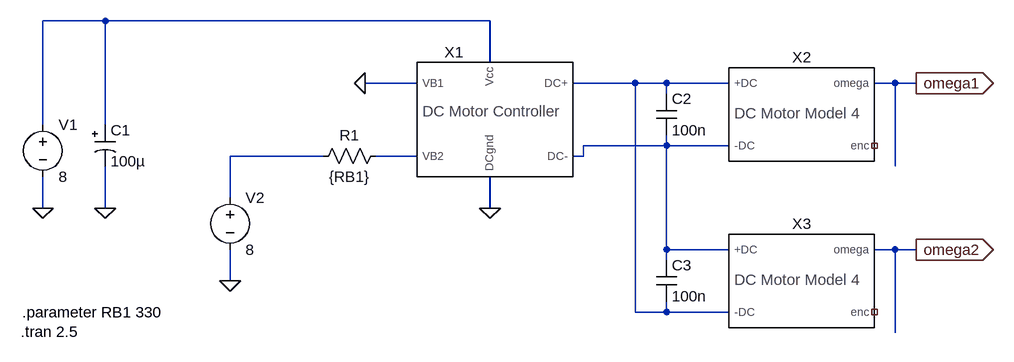
[diagram p0: schematic hbridge-2motor.asc]
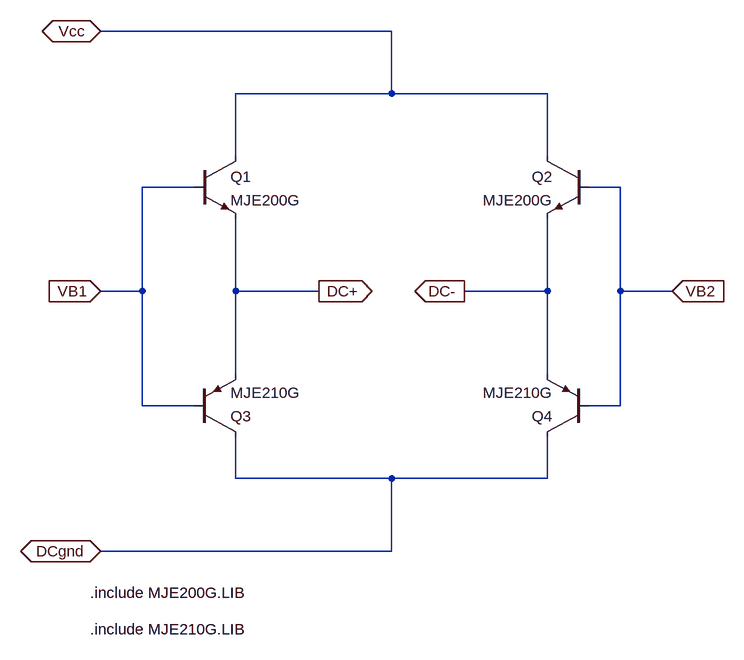
[diagram p1: sub-circuit dc_motor_driver.asc]
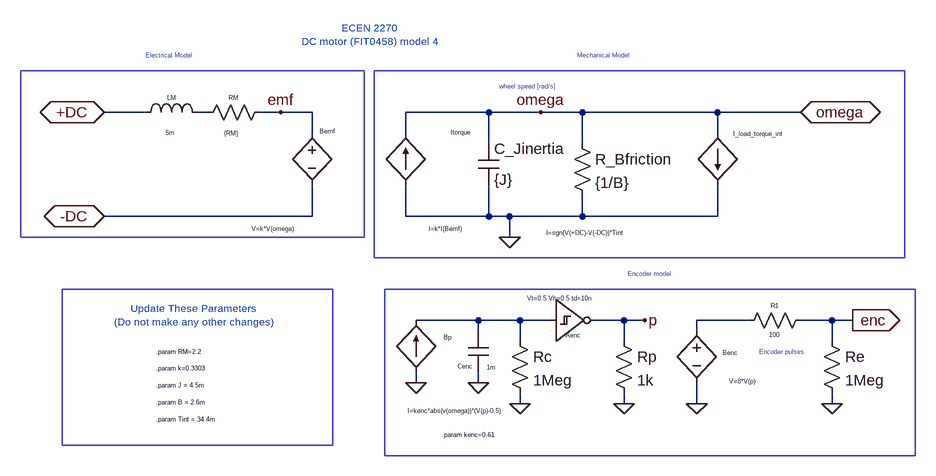
[diagram p2: sub-circuit dc_motor_model4.asc]
hbridge-2motor.asc, the LTspice schematic file:
Version 4
SHEET 1 1772 680
WIRE 144 -32 48 -32
WIRE 736 -32 144 -32
WIRE 736 32 736 -32
WIRE 624 64 544 64
WIRE 960 64 864 64
WIRE 1008 64 960 64
WIRE 1104 64 1008 64
WIRE 1360 64 1328 64
WIRE 1392 64 1360 64
WIRE 1008 80 1008 64
WIRE 48 128 48 -32
WIRE 144 128 144 -32
WIRE 1008 160 1008 144
WIRE 1008 160 880 160
WIRE 1104 160 1008 160
WIRE 480 176 336 176
WIRE 624 176 560 176
WIRE 880 176 880 160
WIRE 880 176 864 176
WIRE 1360 192 1360 64
WIRE 336 240 336 176
WIRE 48 256 48 208
WIRE 144 256 144 192
WIRE 736 256 736 208
WIRE 1008 320 1008 160
WIRE 1104 320 1008 320
WIRE 1360 320 1328 320
WIRE 1392 320 1360 320
WIRE 1008 336 1008 320
WIRE 336 368 336 320
WIRE 960 416 960 64
WIRE 1008 416 1008 400
WIRE 1008 416 960 416
WIRE 1104 416 1008 416
WIRE 1360 448 1360 320
FLAG 336 368 0
FLAG 144 256 0
FLAG 48 256 0
FLAG 736 256 0
FLAG 1392 64 omega1
IOPIN 1392 64 Out
FLAG 1392 320 omega2
IOPIN 1392 320 Out
FLAG 544 64 0
SYMBOL voltage 48 112 R0
SYMATTR InstName V1
SYMATTR Value 8
SYMBOL voltage 336 224 R0
SYMATTR InstName V2
SYMATTR Value 8
SYMBOL polcap 128 128 R0
SYMATTR InstName C1
SYMATTR Value 100µ
SYMBOL res 576 160 R90
WINDOW 0 0 56 VBottom 2
WINDOW 3 32 56 VTop 2
SYMATTR InstName R1
SYMATTR Value {RB1}
SYMBOL DC_Motor_Driver 704 96 R0
SYMATTR InstName X1
SYMBOL cap 992 80 R0
SYMATTR InstName C2
SYMATTR Value 100n
SYMBOL cap 992 336 R0
SYMATTR InstName C3
SYMATTR Value 100n
SYMBOL DC_motor_model4 1200 112 R0
SYMATTR InstName X2
SYMBOL DC_motor_model4 1200 368 R0
SYMATTR InstName X3
TEXT 16 416 Left 2 !.parameter RB1 330
TEXT 14 446 Left 2 !.tran 2.5

dc_motor_driver.asc, the sub-circuit schematic file:
Version 4
SHEET 1 1272 872
WIRE 128 -336 -320 -336
WIRE 128 -240 128 -336
WIRE 128 -240 -112 -240
WIRE 368 -240 128 -240
WIRE -112 -144 -112 -240
WIRE 368 -144 368 -240
WIRE -176 -96 -256 -96
WIRE 480 -96 432 -96
WIRE -256 64 -256 -96
WIRE -256 64 -320 64
WIRE -112 64 -112 -48
WIRE 16 64 -112 64
WIRE 368 64 368 -48
WIRE 368 64 240 64
WIRE 480 64 480 -96
WIRE 560 64 480 64
WIRE -112 192 -112 64
WIRE 368 192 368 64
WIRE -256 240 -256 64
WIRE -176 240 -256 240
WIRE 480 240 480 64
WIRE 480 240 432 240
WIRE -112 352 -112 288
WIRE 128 352 -112 352
WIRE 368 352 368 288
WIRE 368 352 128 352
WIRE 128 464 128 352
WIRE 128 464 -320 464
FLAG -320 464 DCgnd
IOPIN -320 464 BiDir
FLAG -320 -336 Vcc
IOPIN -320 -336 BiDir
FLAG -320 64 VB1
IOPIN -320 64 In
FLAG 560 64 VB2
IOPIN 560 64 In
FLAG 16 64 DC+
IOPIN 16 64 Out
FLAG 240 64 DC-
IOPIN 240 64 Out
SYMBOL npn -176 -144 R0
SYMATTR InstName Q1
SYMATTR Value MJE200G
SYMBOL pnp -176 288 M180
SYMATTR InstName Q3
SYMATTR Value MJE210G
SYMBOL pnp 432 288 R180
SYMATTR InstName Q4
SYMATTR Value MJE210G
SYMBOL npn 432 -144 M0
SYMATTR InstName Q2
SYMATTR Value MJE200G
TEXT -336 528 Left 2 !.include MJE200G.LIB
TEXT -336 584 Left 2 !.include MJE210G.LIB

dc_motor_model4.asc, the sub-circuit schematic file:
Version 4
SHEET 1 880 680
WIRE -528 -176 -592 -176
WIRE -432 -176 -448 -176
WIRE -320 -176 -352 -176
WIRE -272 -176 -320 -176
WIRE 0 -176 -128 -176
WIRE 80 -176 0 -176
WIRE 144 -176 80 -176
WIRE 352 -176 144 -176
WIRE 480 -176 352 -176
WIRE -272 -144 -272 -176
WIRE -128 -144 -128 -176
WIRE 352 -144 352 -176
WIRE 0 -128 0 -176
WIRE 144 -128 144 -176
WIRE -272 -16 -272 -64
WIRE -272 -16 -592 -16
WIRE -128 -16 -128 -64
WIRE 0 -16 0 -64
WIRE 0 -16 -128 -16
WIRE 32 -16 0 -16
WIRE 144 -16 144 -48
WIRE 144 -16 32 -16
WIRE 352 -16 352 -64
WIRE 352 -16 144 -16
WIRE 32 16 32 -16
WIRE -16 144 -112 144
WIRE 48 144 -16 144
WIRE 96 144 48 144
WIRE 208 144 160 144
WIRE 240 144 208 144
WIRE 400 144 320 144
WIRE 528 144 480 144
WIRE 560 144 528 144
WIRE -16 160 -16 144
WIRE 320 160 320 144
WIRE 48 176 48 144
WIRE 208 176 208 144
WIRE 528 176 528 144
WIRE -112 240 -112 224
WIRE -16 240 -16 224
WIRE 48 272 48 256
WIRE 208 272 208 256
WIRE 320 272 320 240
WIRE 528 272 528 256
FLAG 560 144 enc
IOPIN 560 144 Out
FLAG -112 240 0
FLAG -16 240 0
FLAG 80 -176 omega
FLAG -320 -176 emf
FLAG 240 144 p
FLAG 320 272 0
FLAG -592 -176 +DC
IOPIN -592 -176 BiDir
FLAG -592 -16 -DC
IOPIN -592 -16 BiDir
FLAG 480 -176 omega
IOPIN 480 -176 BiDir
FLAG 32 16 0
FLAG 208 272 0
FLAG 48 272 0
FLAG 528 272 0
SYMBOL Digital\\schmtinv 96 80 R0
WINDOW 3 -37 30 Left 0
WINDOW 0 22 87 Left 0
SYMATTR Value Vt=0.5 Vh=0.5 td=10n
SYMATTR InstName Aenc
SYMBOL bi -112 224 R180
WINDOW 0 -55 54 Left 0
WINDOW 3 -134 -59 Left 0
SYMATTR InstName Bp
SYMATTR Value I=kenc*abs(v(omega))*(V(p)-0.5)
SYMBOL cap -32 160 R0
WINDOW 0 -16 55 Left 0
WINDOW 3 29 56 Left 0
SYMATTR InstName Cenc
SYMATTR Value 1m
SYMBOL ind -544 -160 R270
WINDOW 0 32 56 VTop 0
WINDOW 3 -9 54 VBottom 0
SYMATTR InstName LM
SYMATTR Value 5m
SYMBOL res -448 -160 R270
WINDOW 0 32 56 VTop 0
WINDOW 3 -10 52 VBottom 0
SYMATTR InstName RM
SYMATTR Value {RM}
SYMBOL bv -272 -160 R0
WINDOW 0 12 13 Left 0
WINDOW 3 -93 163 Left 0
SYMATTR InstName Bemf
SYMATTR Value V=k*V(omega)
SYMBOL bi -128 -64 R180
WINDOW 0 -101 81 Left 0
WINDOW 3 -86 -67 Left 0
SYMATTR InstName Itorque
SYMATTR Value I=k*I(Bemf)
SYMBOL cap -16 -128 R0
SYMATTR InstName C_Jinertia
SYMATTR Value {J}
SYMBOL res 128 -144 R0
SYMATTR InstName R_Bfriction
SYMATTR Value {1/B}
SYMBOL bv 320 144 R0
WINDOW 0 40 50 Left 0
WINDOW 3 50 94 Left 0
SYMATTR InstName Benc
SYMATTR Value V=8*V(p)
SYMBOL bi 352 -144 R0
WINDOW 3 -264 153 Left 0
WINDOW 0 24 1 Left 0
SYMATTR Value I=sgn(V(+DC)-V(-DC))*Tint
SYMATTR InstName I_load_torque_int
SYMBOL res 496 128 R90
WINDOW 0 0 56 VBottom 0
WINDOW 3 32 56 VTop 0
SYMATTR InstName R1
SYMATTR Value 100
SYMBOL res 192 160 R0
SYMATTR InstName Rp
SYMATTR Value 1k
SYMBOL res 32 160 R0
SYMATTR InstName Rc
SYMATTR Value 1Meg
SYMBOL res 512 160 R0
SYMATTR InstName Re
SYMATTR Value 1Meg
TEXT -72 320 Left 0 !.param kenc=0.61
TEXT -184 -296 Center 1 ;ECEN 2270\nDC motor (FIT0458) model 4
TEXT 16 -216 Left 0 ;wheel speed [rad/s]
TEXT 416 192 Left 0 ;Encoder pulses
TEXT 248 72 Center 0 ;Encoder model
TEXT -512 192 Left 0 !.param RM=2.2\n \n.param k=0.3303\n \n.param J = 4.5m\n \n.param B = 2.6m\n \n.param Tint = 34.4m
TEXT -456 136 Center 1 ;Update These Parameters\n(Do not make any other changes)
TEXT -528 -264 Left 0 ;Electrical Model
TEXT 136 -264 Left 0 ;Mechanical Model
RECTANGLE Normal -240 336 -656 96
RECTANGLE Normal -192 16 -720 -240
RECTANGLE Normal 640 48 -176 -240
RECTANGLE Normal 656 352 -160 96

The netlist it stands for:
* hbridge-2motor.asc
V1 N001 0 8
V2 N004 0 8
C1 N001 0 100µ
R1 N005 N004 {RB1}
XX1 0 N005 N002 N003 0 N001 dc_motor_driver
C2 N002 N003 100n
C3 N003 N002 100n
XX2 N002 N003 NC_01 omega1 dc_motor_model4
XX3 N003 N002 NC_02 omega2 dc_motor_model4

* block symbol definitions
.subckt dc_motor_driver VB1 VB2 DC+ DC- DCgnd Vcc
Q1 Vcc VB1 DC+ 0 MJE200G
Q3 DCgnd VB1 DC+ 0 MJE210G
Q4 DCgnd VB2 DC- 0 MJE210G
Q2 Vcc VB2 DC- 0 MJE200G
.include MJE200G.LIB
.include MJE210G.LIB
.ends dc_motor_driver

.subckt dc_motor_model4 +DC -DC enc omega
Aenc N002 0 0 0 0 p 0 0 SCHMITT Vt=0.5 Vh=0.5 td=10n
Bp 0 N002 I=kenc*abs(v(omega))*(V(p)-0.5)
Cenc N002 0 1m
LM +DC N001 5m
RM N001 emf {RM}
Bemf emf -DC V=k*V(omega)
B§Itorque 0 omega I=k*I(Bemf)
C_Jinertia omega 0 {J}
R_Bfriction omega 0 {1/B}
Benc N003 0 V=8*V(p)
B§I_load_torque_int omega 0 I=sgn(V(+DC)-V(-DC))*Tint
R1 enc N003 100
Rp p 0 1k
Rc N002 0 1Meg
Re enc 0 1Meg
.param kenc=0.61
* ECEN 2270
* DC motor (FIT0458) model 4
* wheel speed [rad/s]
* Encoder pulses
* Encoder model
.param RM=2.2
.param k=0.3303
.param J = 4.5m
.param B = 2.6m
.param Tint = 34.4m
* Update These Parameters
* (Do not make any other changes)
* Electrical Model
* Mechanical Model
.ends dc_motor_model4

.model NPN NPN
.model PNP PNP
.lib standard.bjt
.parameter RB1 330
.tran 2.5
.backanno
.end